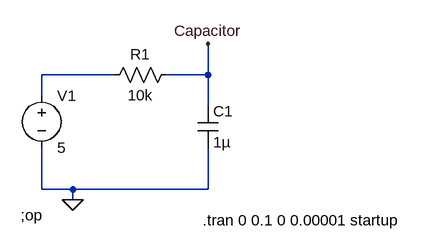
[diagram p0: schematic T2_3_RC_tran.asc]
T2_3_RC_tran.asc, the LTspice schematic file:
Version 4
SHEET 1 880 680
WIRE 192 112 80 112
WIRE 336 112 336 64
WIRE 336 112 272 112
WIRE 80 144 80 112
WIRE 336 160 336 112
WIRE 80 288 80 224
WIRE 128 288 80 288
WIRE 336 288 336 224
WIRE 336 288 128 288
WIRE 128 304 128 288
FLAG 128 304 0
FLAG 336 64 Capacitor
DATAFLAG 336 144 "I(C1)"
SYMBOL voltage 80 128 R0
WINDOW 123 0 0 Left 0
WINDOW 39 0 0 Left 0
SYMATTR InstName V1
SYMATTR Value 5
SYMBOL res 288 96 R90
WINDOW 0 0 56 VBottom 2
WINDOW 3 32 56 VTop 2
SYMATTR InstName R1
SYMATTR Value 10k
SYMBOL cap 320 160 R0
SYMATTR InstName C1
SYMATTR Value 1µ
TEXT 48 328 Left 2 !;op
TEXT 328 336 Left 2 !.tran 0 0.1 0 0.00001 startup

The netlist it stands for:
* T2_3_RC_tran.asc
V1 N001 0 5
R1 Capacitor N001 10k
C1 Capacitor 0 1µ
;op
.tran 0 0.1 0 0.00001 startup
.backanno
.end